# Altium schematic sheet Inverter.SchDoc
size A3; SheetNumber: 2; SheetTotal: 5
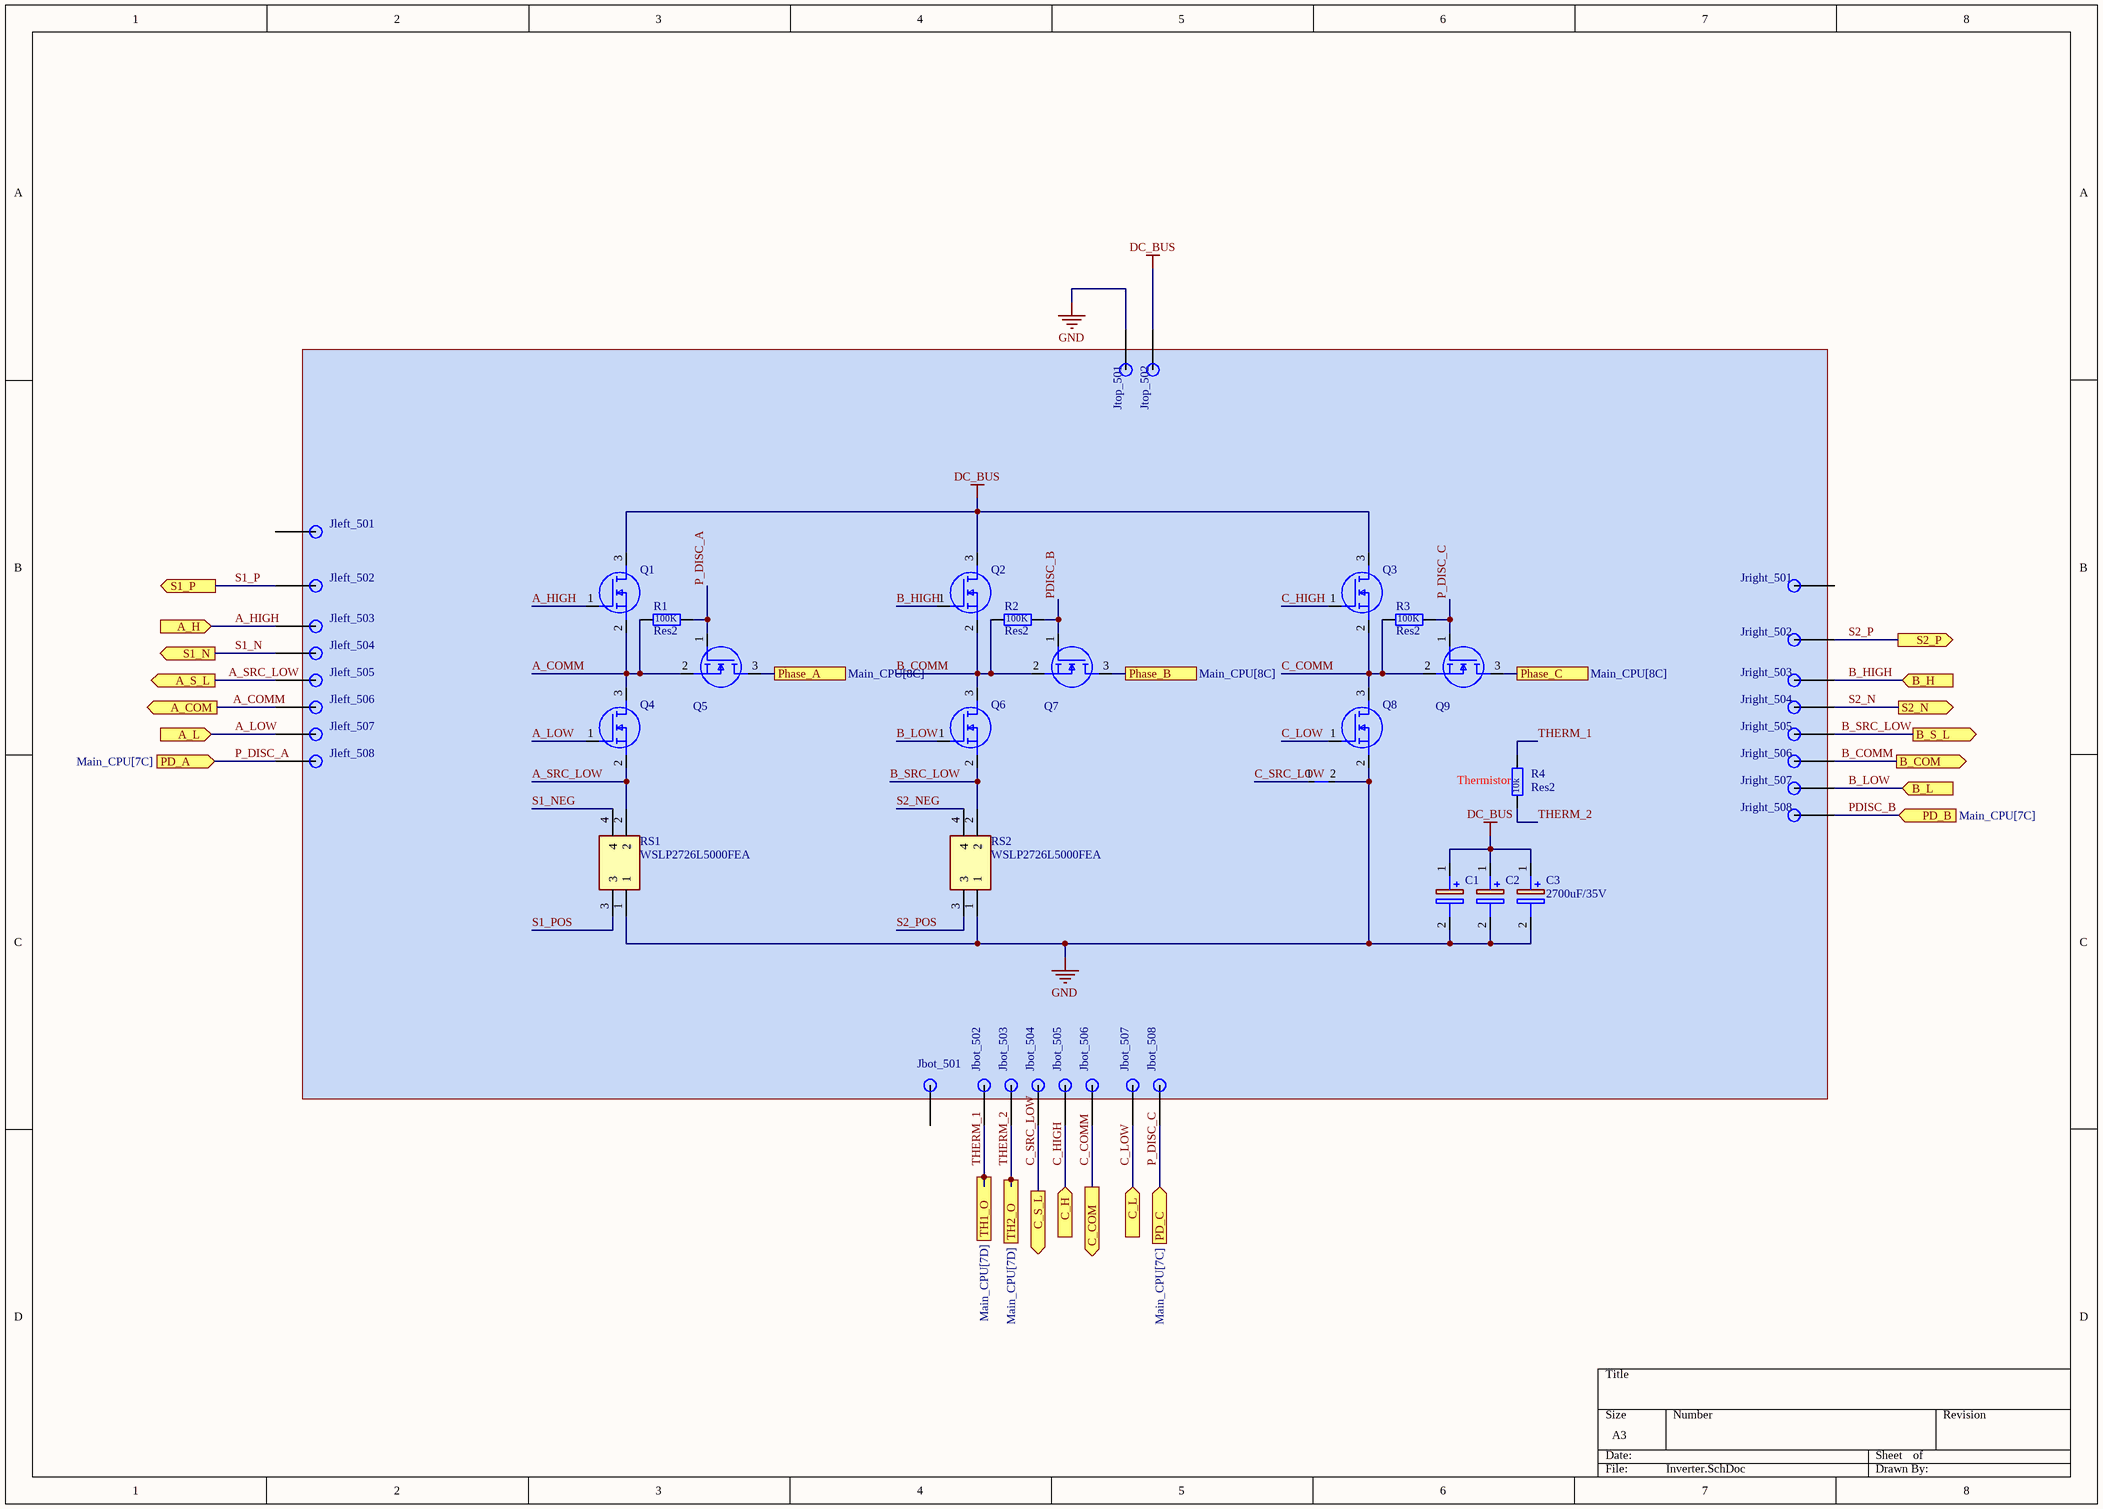
[diagram p0: Inverter.SchDoc]

## Parts
C1  2700uF/35V  [CAPPM6032X280N]  (value not drawn)  (graphical)
C2  2700uF/35V  [CAPPM6032X280N]  (value not drawn)  (graphical)
C3  2700uF/35V  [CAPPM6032X280N]  (graphical)
Jbot_501  Pin_1mm  [Pin_1.5mm]  (value not drawn)  (no BOM)
Jbot_502  Pin_1mm  [Pin_1mm]  (value not drawn)  (no BOM)
Jbot_503  Pin_1mm  [Pin_1mm]  (value not drawn)  (no BOM)
Jbot_504  Pin_1mm  [Pin_1mm]  (value not drawn)  (no BOM)
Jbot_505  Pin_1mm  [Pin_1mm]  (value not drawn)  (no BOM)
Jbot_506  Pin_1mm  [Pin_1mm]  (value not drawn)  (no BOM)
Jbot_507  Pin_1mm  [Pin_1mm]  (value not drawn)  (no BOM)
Jbot_508  Pin_1mm  [Pin_1mm]  (value not drawn)  (no BOM)
Jleft_501  Pin_1mm  [Pin_1.5mm]  (value not drawn)  (no BOM)
Jleft_502  Pin_1mm  [Pin_1mm]  (value not drawn)  (no BOM)
Jleft_503  Pin_1mm  [Pin_1mm]  (value not drawn)  (no BOM)
Jleft_504  Pin_1mm  [Pin_1mm]  (value not drawn)  (no BOM)
Jleft_505  Pin_1mm  [Pin_1mm]  (value not drawn)  (no BOM)
Jleft_506  Pin_1mm  [Pin_1mm]  (value not drawn)  (no BOM)
Jleft_507  Pin_1mm  [Pin_1mm]  (value not drawn)  (no BOM)
Jleft_508  Pin_1mm  [Pin_1mm]  (value not drawn)  (no BOM)
Jright_501  Pin_1mm  [Pin_1.5mm]  (value not drawn)  (no BOM)
Jright_502  Pin_1mm  [Pin_1mm]  (value not drawn)  (no BOM)
Jright_503  Pin_1mm  [Pin_1mm]  (value not drawn)  (no BOM)
Jright_504  Pin_1mm  [Pin_1mm]  (value not drawn)  (no BOM)
Jright_505  Pin_1mm  [Pin_1mm]  (value not drawn)  (no BOM)
Jright_506  Pin_1mm  [Pin_1mm]  (value not drawn)  (no BOM)
Jright_507  Pin_1mm  [Pin_1mm]  (value not drawn)  (no BOM)
Jright_508  Pin_1mm  [Pin_1mm]  (value not drawn)  (no BOM)
Jtop_501  Pin_1mm  [Pin_1mm]  (value not drawn)  (no BOM)
Jtop_502  Pin_1mm  [Pin_1mm]  (value not drawn)  (no BOM)
NT501  Net_Tie  [Net_Tie_SMD]  (value not drawn)  (net tie, no BOM)
Q1  IPT010N08NM5ATMA1  [IPT010N08NM5ATMA1]  (value not drawn)  (graphical)
Q2  IPT010N08NM5ATMA1  [IPT010N08NM5ATMA1]  (value not drawn)  (graphical)
Q3  IPT010N08NM5ATMA1  [IPT010N08NM5ATMA1]  (value not drawn)  (graphical)
Q4  IPT010N08NM5ATMA1  [IPT010N08NM5ATMA1]  (value not drawn)  (graphical)
Q5  IPT010N08NM5ATMA1  [IPT010N08NM5ATMA1]  (value not drawn)  (graphical)
Q6  IPT010N08NM5ATMA1  [IPT010N08NM5ATMA1]  (value not drawn)  (graphical)
Q7  IPT010N08NM5ATMA1  [IPT010N08NM5ATMA1]  (value not drawn)  (graphical)
Q8  IPT010N08NM5ATMA1  [IPT010N08NM5ATMA1]  (value not drawn)  (graphical)
Q9  IPT010N08NM5ATMA1  [IPT010N08NM5ATMA1]  (value not drawn)  (graphical)
R1  Res2  value 100K  [AXIAL-0.4]  (graphical)
R2  Res2  value 100K  [AXIAL-0.4]  (graphical)
R3  Res2  value 100K  [AXIAL-0.4]  (graphical)
R4  Res2  value 10k  [AXIAL-0.4]  (graphical)
RS1  WSLP2726L5000FEA  [WSL27261L000FEA]  (graphical)
RS2  WSLP2726L5000FEA  [WSL27261L000FEA]  (graphical)

## Blocks framed on the sheet
Thermistor: C1-C3 Jbot_501-Jbot_508 Jleft_501-Jleft_508 Jright_501-Jright_508 Jtop_501 Jtop_502 NT501 Q1-Q9 R1-R4 RS1 RS2

## Ports
A_COM (out, see Main_CPU[7C], Gate_Driver[2B]), A_H (in, see Main_CPU[7C], Gate_Driver[2B]), A_L (in, see Main_CPU[7C], Gate_Driver[2B]), A_S_L (out, see Main_CPU[7C], Gate_Driver[2B]), B_COM (out, see Main_CPU[7C], Gate_Driver[2B]), B_H (in, see Main_CPU[7C], Gate_Driver[2B]), B_L (in, see Main_CPU[7C], Gate_Driver[2B]), B_S_L (out, see Main_CPU[7C], Gate_Driver[2C]), C_COM (out, see Main_CPU[7D], Gate_Driver[2C]), C_H (in, see Main_CPU[7D], Gate_Driver[2C]), C_L (in, see Main_CPU[7D], Gate_Driver[2C]), C_S_L (out, see Main_CPU[7D], Gate_Driver[2C]), PD_A (in, see Main_CPU[7C]), PD_B (in, see Main_CPU[7C]), PD_C (in, see Main_CPU[7C]), Phase_A (see Main_CPU[8C]), Phase_B (see Main_CPU[8C]), Phase_C (see Main_CPU[8C]), S1_N (out, see Main_CPU[7D], Gate_Driver[2C]), S1_P (out, see Main_CPU[7D], Gate_Driver[2C]), S2_N (out, see Main_CPU[7D]), S2_P (out, see Main_CPU[7D]), TH1_O (out, see Main_CPU[7D]), TH2_O (out, see Main_CPU[7D])

## Nets
DC_BUS: C1.1(+) C2.1(+) C3.1(+) Jtop_502.1 Q1.3(D) Q2.3(D) Q3.3(D)
GND: C1.2(-) C2.2(-) C3.2(-) Jtop_501.1 NT501.2 Q8.2(S) RS1.1 RS2.1
A_COMM: Jleft_506.1 Q1.2(S) Q4.3(D) Q5.2(S) R1.1 ; port A_COM
A_HIGH: Jleft_503.1 Q1.1(G) ; port A_H
A_LOW: Jleft_507.1 Q4.1(G) ; port A_L
A_SRC_LOW: Jleft_505.1 Q4.2(S) RS1.2 ; port A_S_L
B_COMM: Jright_506.1 Q2.2(S) Q6.3(D) Q7.2(S) R2.1 ; port B_COM
B_HIGH: Jright_503.1 Q2.1(G) ; port B_H
B_LOW: Jright_507.1 Q6.1(G) ; port B_L
B_SRC_LOW: Jright_505.1 Q6.2(S) RS2.2 ; port B_S_L
C_COMM: Jbot_506.1 Q3.2(S) Q8.3(D) Q9.2(S) R3.1 ; port C_COM
C_HIGH: Jbot_505.1 Q3.1(G) ; port C_H
C_LOW: Jbot_507.1 Q8.1(G) ; port C_L
C_SRC_LOW: Jbot_504.1 NT501.1 ; port C_S_L
P_DISC_A: Jleft_508.1 Q5.1(G) R1.2 ; port PD_A
P_DISC_C: Jbot_508.1 Q9.1(G) R3.2 ; port PD_C
PDISC_B: Jright_508.1 Q7.1(G) R2.2 ; port PD_B
Phase_A: Q5.3(D) ; port Phase_A
Phase_B: Q7.3(D) ; port Phase_B
Phase_C: Q9.3(D) ; port Phase_C
S1_N: Jleft_504.1 ; port S1_N
S1_NEG: RS1.4
S1_P: Jleft_502.1 ; port S1_P
S1_POS: RS1.3
S2_N: Jright_504.1 ; port S2_N
S2_NEG: RS2.4
S2_P: Jright_502.1 ; port S2_P
S2_POS: RS2.3
THERM_1: Jbot_502.1 R4.2 ; port TH1_O
THERM_2: Jbot_503.1 R4.1 ; port TH2_O

Not connected (* = marked no-connect by the designer): Jbot_501 1; Jleft_501 1; Jright_501 1

## Library data of the parts
C1-C3 = 293D106X9025C2TE3: Capacitor Polarised; Manufacturer_Name: Vishay; Datasheet Link: http://www.vishay.com/docs/40002/293d.pdf; Height: 2.8mm; Manufacturer_Part_Number: 293D106X9025C2TE3; Mouser Part Number: 74-293D106X9025C2TE3; Mouser Price/Stock: https://www.mouser.co.uk/ProductDetail/Vishay-Sprague/293D106X9025C2TE3?qs=N31o%252Bt096gtaEBFlCxpfFQ%3D%3D; Arrow Part Number: 293D106X9025C2TE3; Arrow Price/Stock: https://www.arrow.com/en/products/293d106x9025c2te3/vishay?region=nac
Jbot_501-Jbot_508 Jleft_501-Jleft_508 Jright_501-Jright_508 Jtop_501 Jtop_502 = Pin_1mm: Pin_Connector; MPN: X5511FV-02-C70D30-1000; Link: https://www.lcsc.com/product-detail/Female-Headers_XKB-Connection-X5511FV-02-C70D30-1000_C2684752.html; Price: 0.0742
NT501 = Net_Tie: Net Tie
Q1-Q9 = IPT010N08NM5ATMA1: MOSFET (N-Channel); Manufacturer_Name: Infineon; Datasheet Link: https://www.infineon.com/dgdl/Infineon-IPT010N08NM5-DataSheet-v02_00-EN.pdf?fileId=5546d462766cbe860176761d659d581e; Height: 2.4mm; MPN: IPT010N08NM5ATMA1; Mouser Part Number: 726-IPT010N08NM5ATM1; Mouser Price/Stock: https://www.mouser.co.uk/ProductDetail/Infineon-Technologies/IPT010N08NM5ATMA1?qs=DRkmTr78QARZBVXV%252BQr%2FqA%3D%3D
R1-R4 = Res2: Resistor; Published: 8-Jun-2000; LatestRevisionDate: 17-Jul-2002; LatestRevisionNote: Re-released for DXP Platform.; PackageReference: AXIAL-0.4; Publisher: Altium Limited; PackageDescription: Axial Device, Thru-Hole; 2 Leads; 0.4 in Pin Spacing
RS1 RS2 = WSLP2726L5000FEA: Resistor; Manufacturer_Name: Vishay; Datasheet Link: https://www.vishay.com/docs/30179/wslp2726.pdf; Height: 2mm; Manufacturer_Part_Number: WSLP2726L5000FEA; Mouser Part Number: 71-WSLP2726L5000FEA; Mouser Price/Stock: https://www.mouser.co.uk/ProductDetail/Vishay-Dale/WSLP2726L5000FEA?qs=H%252BW4FWGGyHeDwweg1TYd4Q%3D%3D; Arrow Part Number: WSLP2726L5000FEA; Arrow Price/Stock: https://www.arrow.com/en/products/wslp2726l5000fea/vishay?region=nac